# Altium schematic sheet PyNab_Header_LED_RFID.SchDoc: PyNab - Headers / Leds / Sensors
size A3; CompanyName: Enero; DrawnBy: Enero; Engineer: Hugo Balette-pape; Organization: ENERO; Address1: 7, rue ambroise thomas; Address2: 75009; Address3: Paris; Address4: France; Revision: 2.0; SheetNumber: 2; SheetTotal: 4
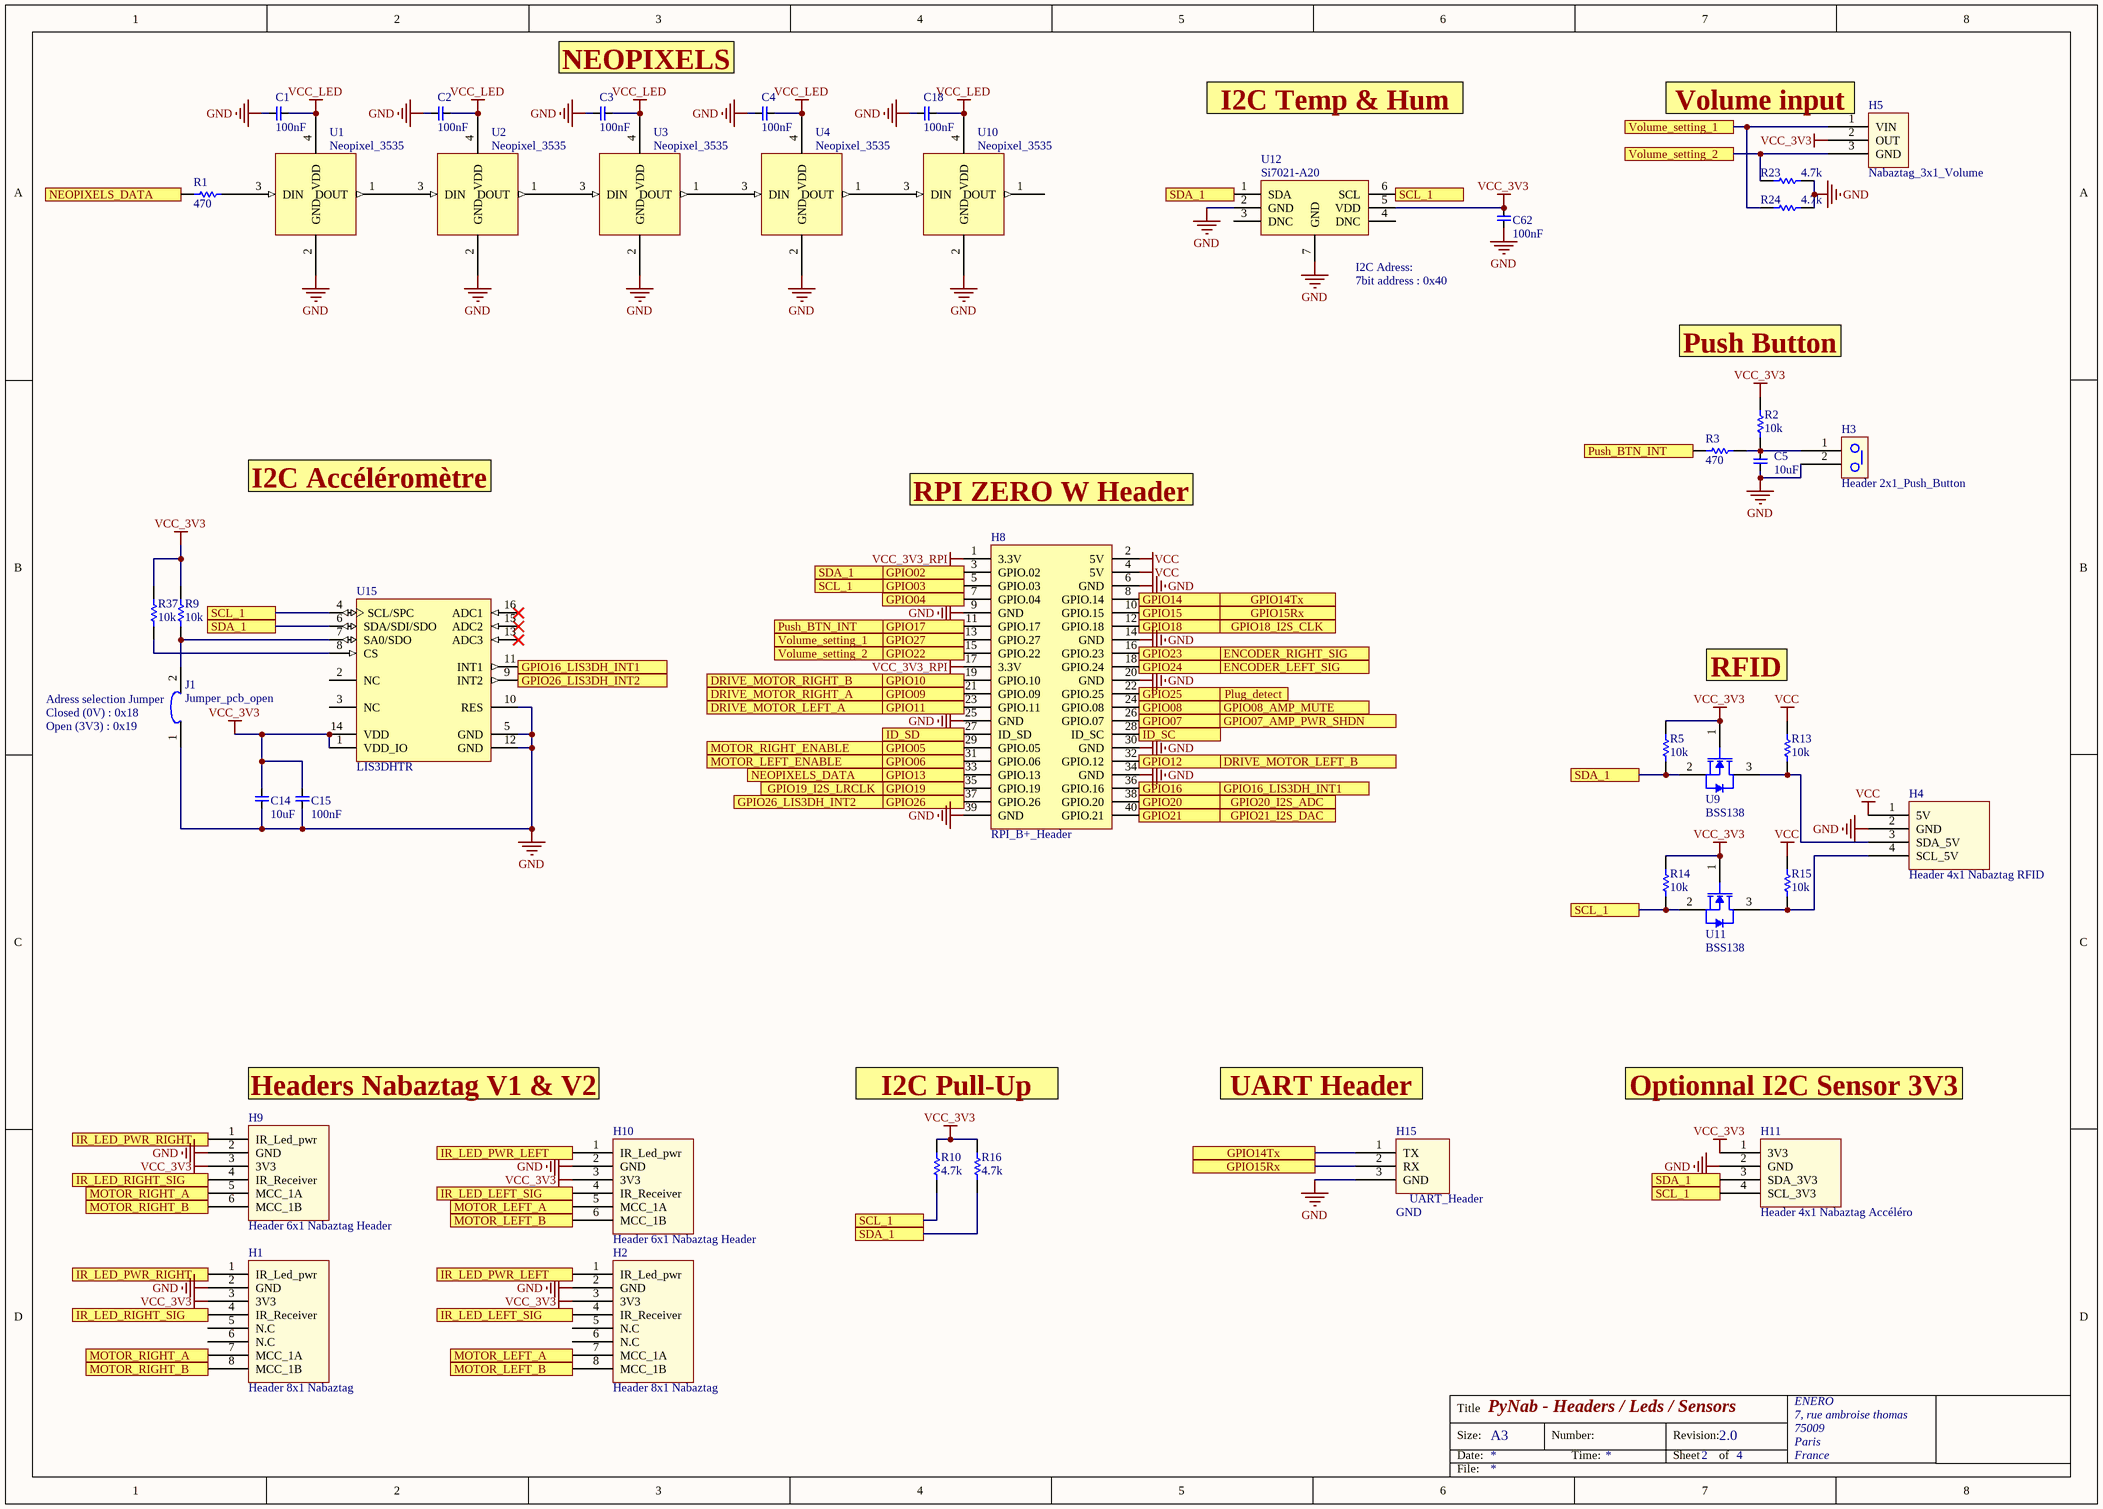
[diagram p0: PyNab_Header_LED_RFID.SchDoc]

## Parts
C1  100nF  [CAP0603]
C2  100nF  [CAP0603]
C3  100nF  [CAP0603]
C4  100nF  [CAP0603]
C5  10uF  [CAP0603]
C14  10uF  [CAP0603]
C15  100nF  [CAP0603]
C18  100nF  [CAP0603]
C62  100nF  [CAP0603]
H1  Header 8x1 Nabaztag  [HDR8x1 NABAZTAG -RIGHT]
H2  Header 8x1 Nabaztag  [HDR8x1 NABAZTAG]
H3  Header 2x1_Push_Button  [HDR2x1_Push_button]
H4  Header 4x1 Nabaztag RFID  [NABAZTAG_RFID_HEADER]
H5  Nabaztag_3x1_Volume  [Nabaztag_Volume_Header]
H8  RPI_B+_Header  [RPI_B+_40Pin_Header]
H9  Header 6x1 Nabaztag Header  [HDR6x1_Nabaztag]
H10  Header 6x1 Nabaztag Header  [HDR6x1_Nabaztag]
H11  Header 4x1 Nabaztag Accéléro  [NABAZTAG_ACCELERO_HEADER 3V3]
H15  GND  [Header_UART_3x1]
J1  Jumper_pcb_open  [Jumper_pcb open 2]
R1  470  [RES0603]
R2  10k  [RES0603]
R3  470  [RES0603]
R5  10k  [RES0603]
R9  10k  [RES0603]
R10  4.7k  [RES0603]
R13  10k  [RES0603]
R14  10k  [RES0603]
R15  10k  [RES0603]
R16  4.7k  [RES0603]
R23  4.7k  [RES0603]
R24  4.7k  [RES0603]
R37  10k  [RES0603]
U1  Neopixel_3535  [NEOPIXEL_35x35]
U2  Neopixel_3535  [NEOPIXEL_35x35]
U3  Neopixel_3535  [NEOPIXEL_35x35]
U4  Neopixel_3535  [NEOPIXEL_35x35]
U9  BSS138  [BSS138]
U10  Neopixel_3535  [NEOPIXEL_35x35]
U11  BSS138  [BSS138]
U12  Si7021-A20  [SON100P300X121_HS-7N]
U15  LIS3DHTR  [STM-LGA-16]

## Ports
DRIVE_MOTOR_LEFT_A, DRIVE_MOTOR_LEFT_B, DRIVE_MOTOR_RIGHT_A, DRIVE_MOTOR_RIGHT_B, ENCODER_LEFT_SIG, ENCODER_RIGHT_SIG, GPIO02, GPIO03, GPIO04, GPIO05, GPIO06, GPIO07, GPIO07_AMP_PWR_SHDN, GPIO08, GPIO08_AMP_MUTE, GPIO09, GPIO10, GPIO11, GPIO12, GPIO13, GPIO14, GPIO14Tx, GPIO15, GPIO15Rx, GPIO16, GPIO16_LIS3DH_INT1, GPIO17, GPIO18, GPIO18_I2S_CLK, GPIO19, GPIO19_I2S_LRCLK, GPIO20, GPIO20_I2S_ADC, GPIO21, GPIO21_I2S_DAC, GPIO22, GPIO23, GPIO24, GPIO25, GPIO26, GPIO26_LIS3DH_INT2, GPIO27, ID_SC, ID_SD, IR_LED_LEFT_SIG, IR_LED_PWR_LEFT, IR_LED_PWR_RIGHT, IR_LED_RIGHT_SIG, MOTOR_LEFT_A, MOTOR_LEFT_B, MOTOR_LEFT_ENABLE, MOTOR_RIGHT_A, MOTOR_RIGHT_B, MOTOR_RIGHT_ENABLE, NEOPIXELS_DATA, Plug_detect, Push_BTN_INT, SCL_1, SDA_1, Volume_setting_1, Volume_setting_2

## Nets
GND: C1.1 C2.1 C3.1 C4.1 C5.1 C14.2 C15.2 C18.1 C62.1 H1.2(GND) H2.2(GND) H3.2 H4.2(GND) H8.6(GND) H8.9(GND) H8.14(GND) H8.20(GND) H8.25(GND) H8.30(GND) H8.34(GND) H8.39(GND) H9.2(GND) H10.2(GND) H11.2(GND) H15.3(GND) J1.1 R23.1 R24.1 U1.2(GND) U2.2(GND) U3.2(GND) U4.2(GND) U10.2(GND) U12.2(GND) U12.7(GND) U15.5(GND) U15.10(RES) U15.12(GND)
VCC: H4.1(5V) H8.2(5V) H8.4(5V) R13.2 R15.2
VCC_3V3: C14.1 C15.1 C62.2 H1.3(3V3) H2.3(3V3) H5.2(OUT) H9.3(3V3) H10.3(3V3) H11.1(3V3) R2.2 R5.2 R9.1 R10.2 R14.2 R16.2 R37.1 U9.1(G) U11.1(G) U12.5(VDD) U15.1(VDD_IO) U15.14(VDD)
VCC_3V3_RPI: H8.1(3.3V) H8.17(3.3V)
VCC_LED: C1.2 C2.2 C3.2 C4.2 C18.2 U1.4(VDD) U2.4(VDD) U3.4(VDD) U4.4(VDD) U10.4(VDD)
DRIVE_MOTOR_LEFT_A: H8.23(GPIO.11) ; port DRIVE_MOTOR_LEFT_A, port GPIO11
DRIVE_MOTOR_LEFT_B: H8.32(GPIO.12) ; port DRIVE_MOTOR_LEFT_B, port GPIO12
DRIVE_MOTOR_RIGHT_A: H8.21(GPIO.09) ; port DRIVE_MOTOR_RIGHT_A, port GPIO09
DRIVE_MOTOR_RIGHT_B: H8.19(GPIO.10) ; port DRIVE_MOTOR_RIGHT_B, port GPIO10
ENCODER_LEFT_SIG: H8.18(GPIO.24) ; port ENCODER_LEFT_SIG, port GPIO24
ENCODER_RIGHT_SIG: H8.16(GPIO.23) ; port ENCODER_RIGHT_SIG, port GPIO23
GPIO02: H8.3(GPIO.02) H11.3(SDA_3V3) R5.1 R16.1 U9.2(S) U12.1(SDA) U15.6(SDA/SDI/SDO) ; port GPIO02, port SDA_1
GPIO03: H8.5(GPIO.03) H11.4(SCL_3V3) R10.1 R14.1 U11.2(S) U12.6(SCL) U15.4(SCL/SPC) ; port GPIO03, port SCL_1
GPIO04: H8.7(GPIO.04) ; port GPIO04
GPIO05: H8.29(GPIO.05) ; port MOTOR_RIGHT_ENABLE, port GPIO05
GPIO06: H8.31(GPIO.06) ; port MOTOR_LEFT_ENABLE, port GPIO06
GPIO07: H8.26(GPIO.07) ; port GPIO07, port GPIO07_AMP_PWR_SHDN
GPIO08: H8.24(GPIO.08) ; port GPIO08, port GPIO08_AMP_MUTE
GPIO13: H8.33(GPIO.13) R1.1 ; port NEOPIXELS_DATA, port GPIO13
GPIO14: H8.8(GPIO.14) H15.1(TX) ; port GPIO14, port GPIO14Tx
GPIO15: H8.10(GPIO.15) H15.2(RX) ; port GPIO15, port GPIO15Rx
GPIO16: H8.36(GPIO.16) U15.11(INT1) ; port GPIO16, port GPIO16_LIS3DH_INT1
GPIO17: H8.11(GPIO.17) R3.1 ; port GPIO17, port Push_BTN_INT
GPIO18: H8.12(GPIO.18) ; port GPIO18, port GPIO18_I2S_CLK
GPIO19: H8.35(GPIO.19) ; port GPIO19, port GPIO19_I2S_LRCLK
GPIO20: H8.38(GPIO.20) ; port GPIO20, port GPIO20_I2S_ADC
GPIO21: H8.40(GPIO.21) ; port GPIO21, port GPIO21_I2S_DAC
GPIO22: H5.3(GND) H8.15(GPIO.22) R23.2 ; port GPIO22, port Volume_setting_2
GPIO25: H8.22(GPIO.25) ; port GPIO25, port Plug_detect
GPIO26: H8.37(GPIO.26) U15.9(INT2) ; port GPIO26, port GPIO26_LIS3DH_INT2
GPIO27: H5.1(VIN) H8.13(GPIO.27) R24.2 ; port GPIO27, port Volume_setting_1
ID_SC: H8.28(ID_SC) ; port ID_SC
ID_SD: H8.27(ID_SD) ; port ID_SD
IR_LED_LEFT_SIG: H2.4(IR_Receiver) H10.4(IR_Receiver) ; port IR_LED_LEFT_SIG
IR_LED_PWR_LEFT: H2.1(IR_Led_pwr) H10.1(IR_Led_pwr) ; port IR_LED_PWR_LEFT
IR_LED_PWR_RIGHT: H1.1(IR_Led_pwr) H9.1(IR_Led_pwr) ; port IR_LED_PWR_RIGHT
IR_LED_RIGHT_SIG: H1.4(IR_Receiver) H9.4(IR_Receiver) ; port IR_LED_RIGHT_SIG
MOTOR_LEFT_A: H2.7(MCC_1A) H10.5(MCC_1A) ; port MOTOR_LEFT_A
MOTOR_LEFT_B: H2.8(MCC_1B) H10.6(MCC_1B) ; port MOTOR_LEFT_B
MOTOR_RIGHT_A: H1.7(MCC_1A) H9.5(MCC_1A) ; port MOTOR_RIGHT_A
MOTOR_RIGHT_B: H1.8(MCC_1B) H9.6(MCC_1B) ; port MOTOR_RIGHT_B
NetC5_2: C5.2 H3.1 R2.1 R3.2
NetH4_3: H4.3(SDA_5V) R13.1 U9.3(D)
NetH4_4: H4.4(SCL_5V) R15.1 U11.3(D)
NetJ1_2: J1.2 R9.2 U15.7(SA0/SDO)
NetR1_2: R1.2 U1.3(DIN)
NetR37_2: R37.2 U15.8(CS)
NetU1_1: U1.1(DOUT) U2.3(DIN)
NetU2_1: U2.1(DOUT) U3.3(DIN)
NetU3_1: U3.1(DOUT) U4.3(DIN)
NetU4_1: U4.1(DOUT) U10.3(DIN)

Not connected (* = marked no-connect by the designer): H1 5(N.C) 6(N.C); H2 5(N.C) 6(N.C); U10 1(DOUT); U12 3(DNC) 4(DNC); U15 2(NC) 3(NC) 13(ADC3)* 15(ADC2)* 16(ADC1)*

## Notes on the sheet
- NEOPIXELS
- I2C Temp & Hum
- (near H5) Volume input
- (near U12) I2C Adress:
- 7bit address : 0x40
- Push Button
- I2C Accéléromètre
- RPI ZERO W Header
- (near J1) Adress selection Jumper
- (near J1) Closed (0V) : 0x18
- RFID
- (near J1) Open (3V3) : 0x19
- Headers Nabaztag V1 & V2
- I2C Pull-Up
- UART Header
- Optionnal I2C Sensor 3V3
- Title
- Size:
- Date:
- A3
- Number:
- Time:
- Revision:
- Sheet
- of
- File:
- (in symbol GND) UART_Header

## Library data of the parts
C1-C5 C14 C15 C18 C62 = Capacitor_np: Non-polarised capacitor
  C1-C4 C15 C18 C62: Value: 100nF
  C5 C14: Value: 10uF
H3 = Header 2x1_Push_Button: Push_Button header
H8 = RPI_B+_40Pin_Header
R1-R3 R5 R9 R10 R13-R16 R23 R24 R37 = Resistor1: Resistor
  R1 R3: Value: 470
  R2 R5 R9 R13-R15 R37: Value: 10k
  R10 R16 R23 R24: Value: 4.7k
U15 = CMP-0234-00055-4: Manufacturer: STMicroelectronics; Interface: I2C, SPI; Packing: Tape and Reel; Wide Supply Voltage: 1.71 to 3.6 V; Output Type: Digital; Bandwidth: 5 kHz; Current Consumption in Power-Down mode: 0.5 uA; ComponentLink2Description: Datasheet; ComponentLink3URL: http://www.st.com/st-web-ui/static/active/en/resource/technical/document/datasheet/CD00274221.pdf; Mounting Technology: Surface Mount; PackageReference: LGA-16; PackageDescription: 16-Pin Land Grid Array, Body 3 x 3 mm, Pitch 0.5 mm; ComponentLink3Description: Package Specification; DatasheetVersion: Rev. 1; Operating Temperature: -40 to 85 degC; PartNumber: LIS3DHTR; ComponentLink1Description: Manufacturer URL; ComponentLink1URL: http://www.st.com/; ComponentLink2URL: http://www.st.com/st-web-ui/static/active/en/resource/technical/document/datasheet/CD00274221.pdf; RoHS: TRUE